# EAGLE schematic rapidshark-main-breakout-bottom-mk-1.0 (EAGLE 6.5.0)
AUTHOR: sean@yak.net
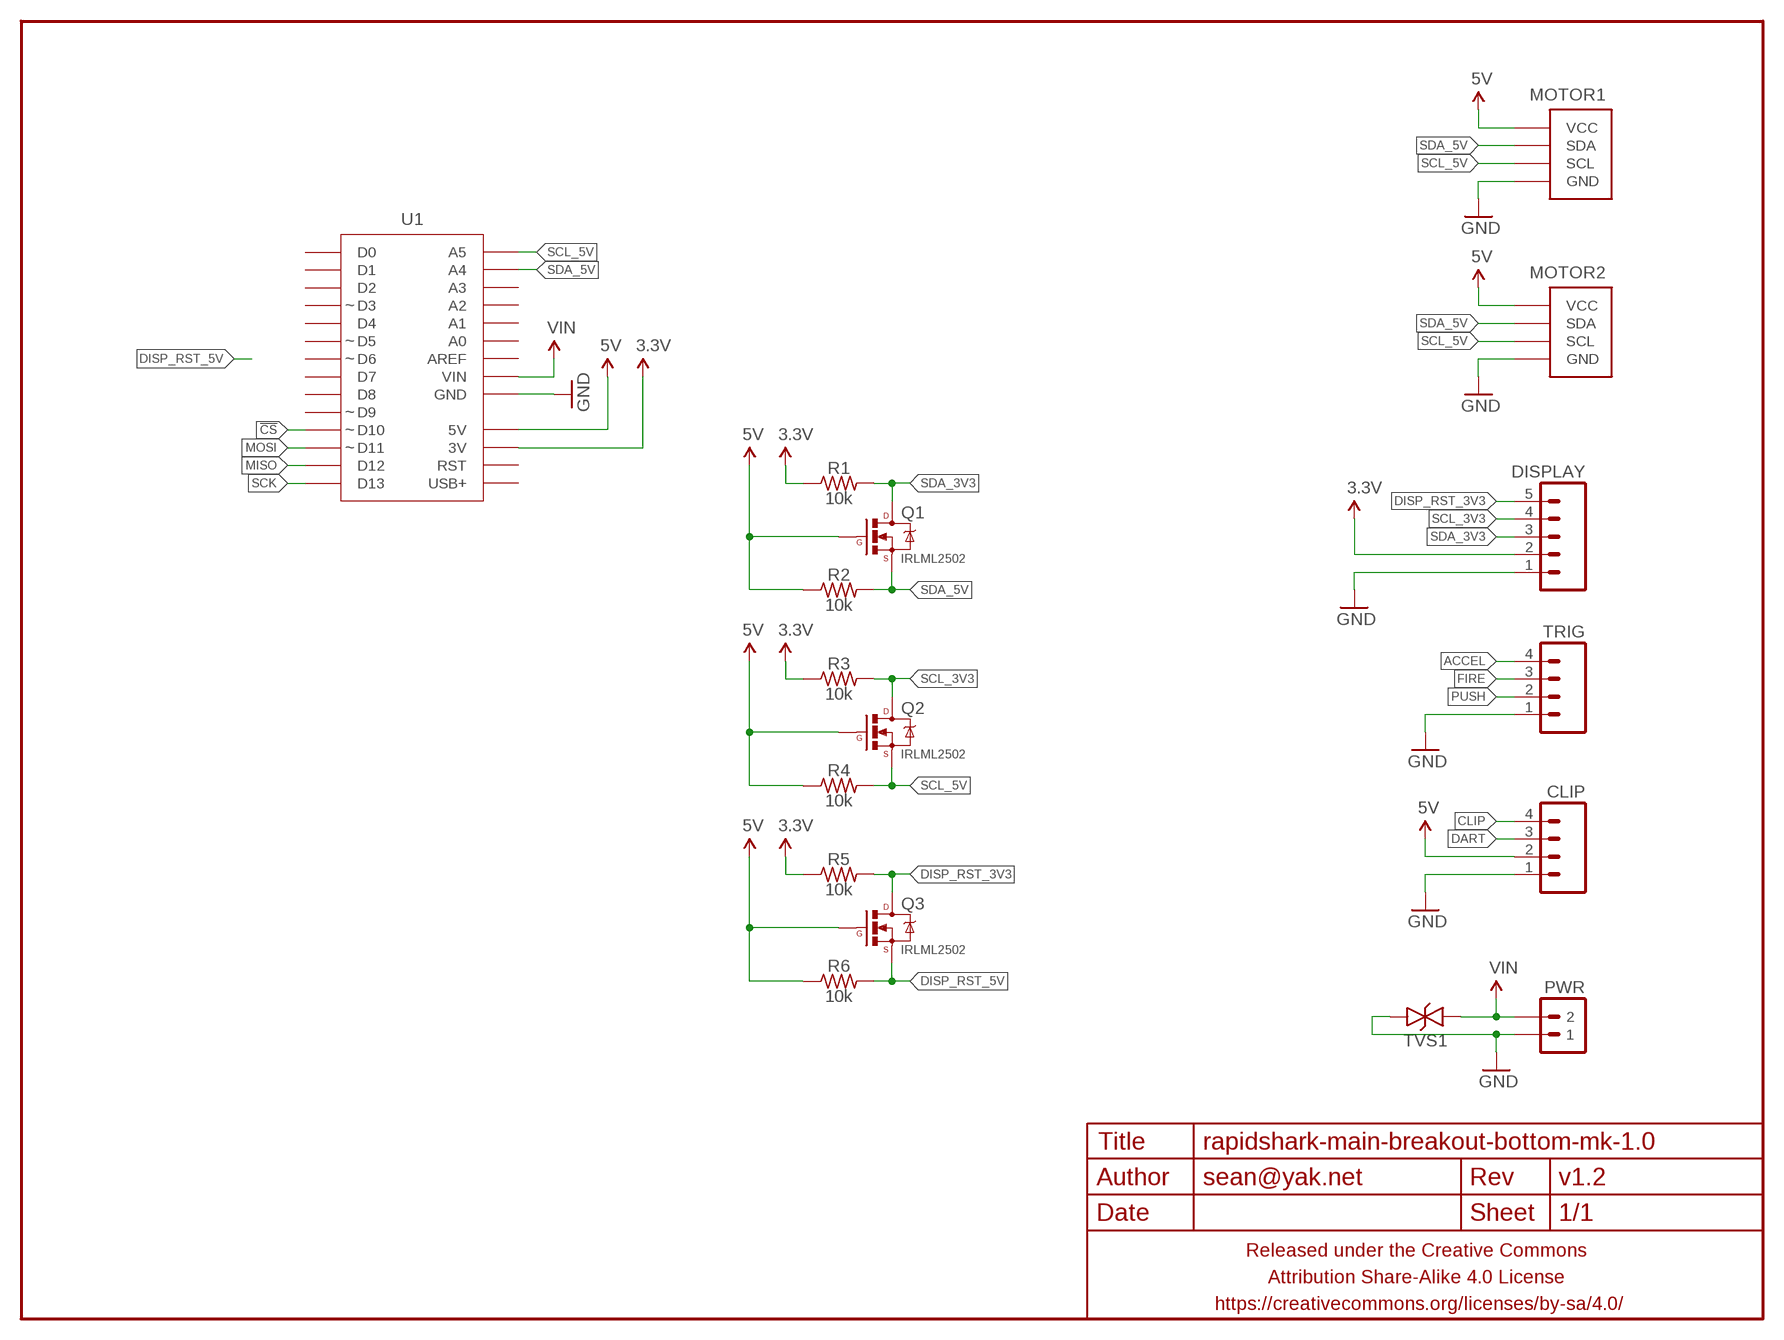
[diagram p0: schematic, sheet 1]

## Parts
CLIP  M04JST-PTH-VERT  [JST-4-PH-VERT-PTH]
DISPLAY  M05JST-PH-VERT-PTH  [JST-5-PH-VERT-PTH]
FRAME1  FRAME-LETTERNO_PACKAGE  [DUMMY]
MOTOR1  M04-I2CJST-4-PH-VERT-NS  [JST-4-PH-VERT-PTH]
MOTOR2  M04-I2CJST-4-PH-VERT-NS  [JST-4-PH-VERT-PTH]
PWR  M02PTH-CENTERED-R+  [1X02-CENTER-R+]
Q1  IRLML2502  MOSFET-NCHANNELIRLML2502  [SOT23]
Q2  IRLML2502  MOSFET-NCHANNELIRLML2502  [SOT23]
Q3  IRLML2502  MOSFET-NCHANNELIRLML2502  [SOT23]
R1  10k  RESISTORR0603  [R0603]
R2  10k  RESISTORR0603  [R0603]
R3  10k  RESISTORR0603  [R0603]
R4  10k  RESISTORR0603  [R0603]
R5  10k  RESISTORR0603  [R0603]
R6  10k  RESISTORR0603  [R0603]
TRIG  M04JST-PTH-VERT  [JST-4-PH-VERT-PTH]
TVS1  TVSSMA  [SMA-DIODE-TVS-BIDIR]
U1  ADAFRUIT_METRO_MININOHOLES-OUTSIDER  [ADAFRUIT_METRO_MINI_OUTSIDER]

## Nets
3.3V: DISPLAY.2 R1.1 R3.1 R5.1 U1.17(3V)
5V: CLIP.2 MOTOR1.2(VCC) MOTOR2.2(VCC) Q1.1(G) Q2.1(G) Q3.1(G) R2.1 R4.1 R6.1 U1.18(5V)
!CS: U1.11(D10)
ACCEL: TRIG.4
CLIP: CLIP.4
DART: CLIP.3
DISP_RST_3V3: DISPLAY.5 Q3.3(D) R5.2
DISP_RST_5V: Q3.2(S) R6.2
FIRE: TRIG.3
GND: CLIP.1 DISPLAY.1 MOTOR1.1(GND) MOTOR2.1(GND) PWR.1 TRIG.1 TVS1.2 U1.19(GND) U1.20(GND)
MISO: U1.13(D12)
MOSI: U1.12(D11)
PUSH: TRIG.2
SCK: U1.14(D13)
SCL_3V3: DISPLAY.4 Q2.3(D) R3.2
SCL_5V: MOTOR1.4(SCL) MOTOR2.4(SCL) Q2.2(S) R4.2 U1.28(A5)
SDA_3V3: DISPLAY.3 Q1.3(D) R1.2
SDA_5V: MOTOR1.3(SDA) MOTOR2.3(SDA) Q1.2(S) R2.2 U1.27(A4)
VIN: PWR.2 TVS1.1 U1.21(VIN)
Unconnected: U1.1(D0) U1.2(D1) U1.3(D2) U1.4(D3) U1.5(D4) U1.6(D5) U1.7(D6) U1.8(D7) U1.9(D8) U1.10(D9) U1.15(USB+) U1.16(RST) U1.22(AREF) U1.23(A0) U1.24(A1) U1.25(A2) U1.26(A3)

## Library data of the parts
CLIP TRIG = A_butts:M04: Header 4 Standard 4-pin 0.1" header. Use with straight break away headers (SKU : PRT-00116), right angle break away headers (PRT-00553), swiss pins (PRT-00743), machine pins (PRT-00117), and female headers (PRT-00115). Molex polarized connector foot print use with SKU : PRT-08231 with associated crimp pins and housings. 1MM SMD Version SKU: PRT-10208
DISPLAY = A_butts:M05: Header 5 Standard 5-pin 0.1" header. Use with straight break away headers (SKU : PRT-00116), right angle break away headers (PRT-00553), swiss pins (PRT-00743), machine pins (PRT-00117), and female headers (PRT-00115). Molex polarized connector foot print use with SKU : PRT-08230 with associated crimp pins and housings.
FRAME1 = A_butts:FRAME-LETTER: Schematic Frame Standard 8.5x11 US Letter frame; DESIGNER: sean@yak.net; VERSION: v1.2
MOTOR1 MOTOR2 = A_butts:M04-I2C
PWR = A_butts:M02: Standard 2-pin 0.1" header. Use with - straight break away headers ( PRT-00116) - right angle break away headers (PRT-00553) - swiss pins (PRT-00743) - machine pins (PRT-00117) - female headers (PRT-00115) Molex polarized connector foot print use with: PRT-08233 with associated crimp pins and housings. 2.54_SCREWTERM for use with PRT-10571. 3.5mm Screw Terminal footprints for PRT-08084 5mm Screw Terminal footprints for use with PRT-08433
Q1-Q3 = A_butts:MOSFET-NCHANNEL: Common NMOSFET Parts MFG P/N Store ID Prod ID FDD8780 TRANS-09984 SI7820DN TRANS-11055 FDS6630A IC-08089 2N7002PW TRANS-11151 FQP30N06L COM-10213 TRANS-10060 BSS123LT1G TRANS-08345 BSS138 TRANS-00830 BS170 2N7000
R1-R6 = A_butts:RESISTOR: RESISTOR, American symbol
TVS1 = A_butts:TVS: Transient voltage suppressor- prevents ESD on inputs. Ignore package description- MBRA140 is NOT this type of part!!!
U1 = A_butts:ADAFRUIT_METRO_MINI